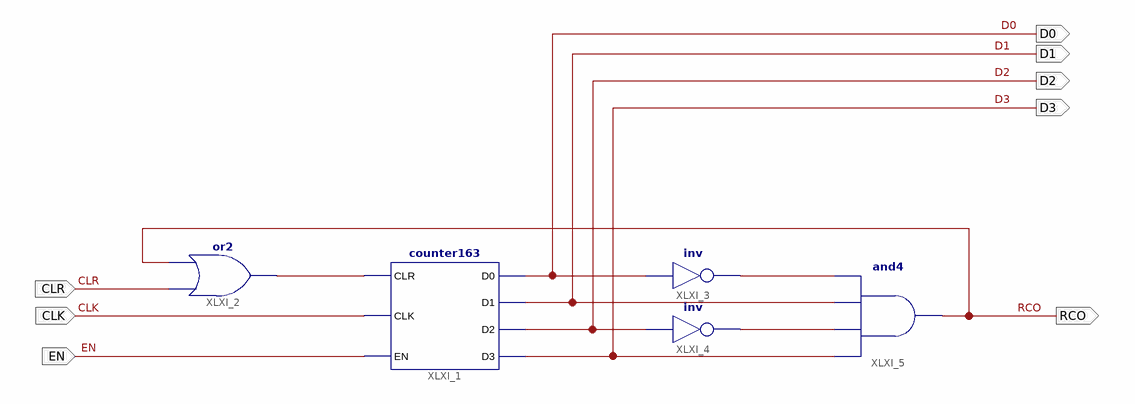
[diagram p0: schematic sheet 1]
// Xilinx ISE schematic mod10.sch (spartan3e) as structural Verilog: 5 symbols, 8 ports
module mod10 (
  input  CLK,
  input  EN,
  input  CLR,
  output D0,
  output RCO,
  output D1,
  output D2,
  output D3
);

  wire XLXN_1, XLXN_6, XLXN_9;

  counter163 XLXI_1 (.CLR(XLXN_1), .CLK(CLK), .EN(EN), .D0(D0), .D1(D1), .D2(D2), .D3(D3));
  or XLXI_2 (XLXN_1, CLR, RCO);
  not XLXI_3 (XLXN_6, D0);
  not XLXI_4 (XLXN_9, D2);
  and XLXI_5 (RCO, D3, XLXN_9, D1, XLXN_6);
endmodule
